# Altium schematic sheet MAZ000174 - Diagrama físico.SchDoc: MAZ000174 - Diagrama físico
size A; ApprovedBy: Christian Ledwidth; CheckedBy: Nahuel Martinez; Author: Santiago Marti; CompanyName: Body Health; DrawnBy: Santiago Marti; Revision: A; SheetNumber: 2; SheetTotal: 2
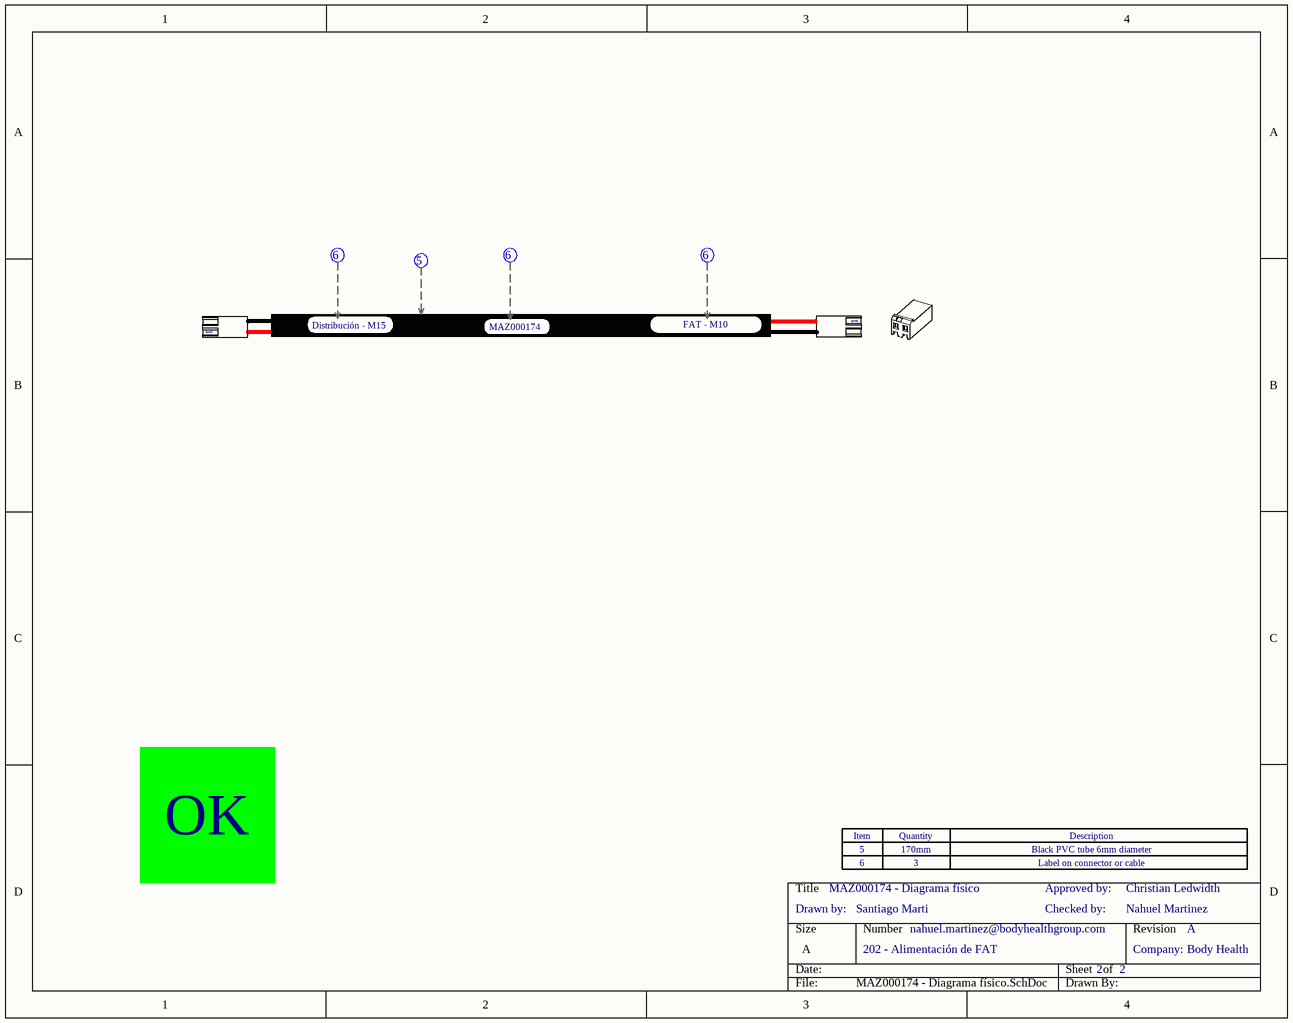
[diagram p0: MAZ000174 - Diagrama físico.SchDoc]

## Parts
Cab1  Cable  (value not drawn)
Cab2  Cable  (value not drawn)
Cab3  Cable  (value not drawn)
Cab4  Cable  (value not drawn)
Con1  SL156-2  (value not drawn)  (parts A,B of 4)
Con2  SL156-2  (value not drawn)  (part A of 4)
Zoc1  Zócalo_Header  (value not drawn)
Zoc6  Zócalo_Item  (value not drawn)
Zoc7  Zócalo_Item  (value not drawn)

## Notes on the sheet
- Distribución - M15
- MAZ000174
- FAT - M10
- OK
- Drawn by:
- 6
- 5
- 3
- 170mm
- Checked by:
- Approved by:
- Label on connector or cable
- Black PVC tube 6mm diameter
- 202 - Alimentación de FAT
- nahuel.martinez@bodyhealthgroup.com
- Company:
- (in symbol Zócalo_Header) Item; Quantity; Description

## Library data of the parts
Cab1-Cab3 = Cable: CallOut: 6; Largo: *mm; Sección: *mm2; Color: *
Cab4 = Cable: CallOut: 5; Largo: *mm; Sección: *mm2; Color: *
Con1 Con2 = SL156-2: CONN RECEPT 2 POS W/RAMP SL-156; Cod.Fabricante: 640250-2; Fabricante: TE Connectivity AMP Connectors; Cod.DigiKey: A19950-ND; ComponentLink1Description: Manufacturer Link; ComponentLink1URL: https://www.te.com/commerce/DocumentDelivery/DDEController?Action=srchrtrv&DocNm=640250&DocType=Customer+Drawing&DocLang=English; DIGIKEYx50: 0.11420; CallOut: *; DIGIKEYx100: NO
Zoc1 = Zócalo_Header: Header para el zócalo de referencias
Zoc6 Zoc7 = Zócalo_Item: Ítem para el zócalo de referencias; Desginator: *; Quantity: *; ItemDescription: *